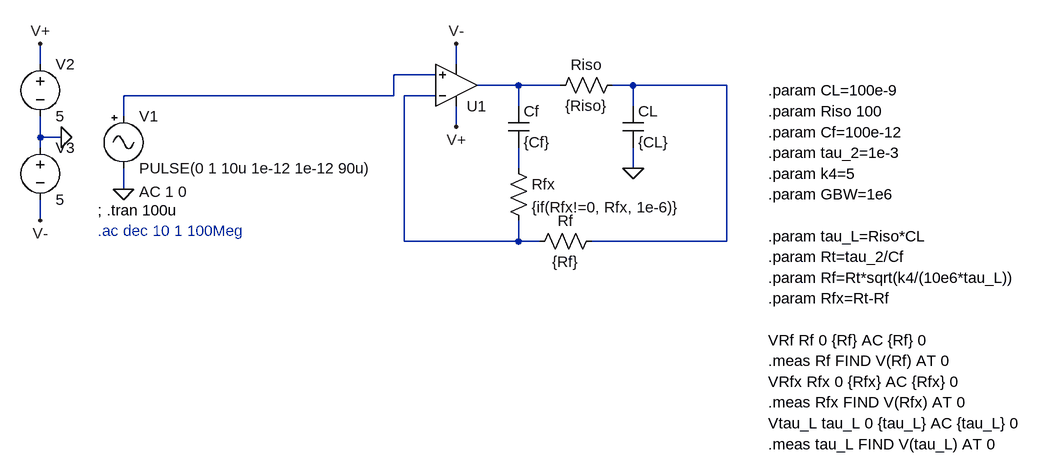
[diagram p0: schematic op-amp-capacitor-compensated.asc]
op-amp-capacitor-compensated.asc, the LTspice schematic file:
Version 4
SHEET 1 2176 680
WIRE -16 32 -16 0
WIRE 624 32 624 0
WIRE 592 48 528 48
WIRE 720 64 656 64
WIRE 784 64 720 64
WIRE 896 64 864 64
WIRE 1040 64 896 64
WIRE 528 80 528 48
WIRE 528 80 112 80
WIRE 592 80 544 80
WIRE 720 96 720 64
WIRE 896 96 896 64
WIRE 112 112 112 80
WIRE 624 128 624 96
WIRE -16 144 -16 112
WIRE 16 144 -16 144
WIRE -16 160 -16 144
WIRE 720 192 720 160
WIRE 896 192 896 160
WIRE 112 224 112 192
WIRE -16 272 -16 240
WIRE 544 304 544 80
WIRE 720 304 720 272
WIRE 720 304 544 304
WIRE 752 304 720 304
WIRE 1040 304 1040 64
WIRE 1040 304 832 304
FLAG 112 224 0
FLAG 624 0 V-
FLAG 624 128 V+
FLAG 16 144 0
FLAG -16 0 V+
FLAG -16 272 V-
FLAG 896 192 0
SYMBOL Misc\\signal 112 96 R0
WINDOW 123 24 132 Left 2
WINDOW 39 0 0 Left 0
SYMATTR Value2 AC 1 0
SYMATTR InstName V1
SYMATTR Value PULSE(0 1 10u 1e-12 1e-12 90u)
SYMBOL OpAmps\\UniversalOpAmp 624 64 M180
SYMATTR InstName U1
SYMATTR Value2 Avol=1e12 GBW=1e12 Vos=0
SYMATTR SpiceLine En=0 Enk=0 In=0 Ink=0 Rin=1e12
SYMBOL voltage -16 16 R0
WINDOW 123 0 0 Left 0
WINDOW 39 0 0 Left 0
SYMATTR InstName V2
SYMATTR Value 5
SYMBOL voltage -16 144 R0
WINDOW 123 0 0 Left 0
WINDOW 39 0 0 Left 0
SYMATTR InstName V3
SYMATTR Value 5
SYMBOL res 880 48 R90
WINDOW 0 0 56 VBottom 2
WINDOW 3 32 56 VTop 2
SYMATTR InstName Riso
SYMATTR Value {Riso}
SYMBOL cap 880 96 R0
SYMATTR InstName CL
SYMATTR Value {CL}
SYMBOL cap 704 96 R0
SYMATTR InstName Cf
SYMATTR Value {Cf}
SYMBOL res 704 176 R0
SYMATTR InstName Rfx
SYMATTR Value {if(Rfx!=0, Rfx, 1e-6)}
SYMBOL res 848 288 R90
WINDOW 0 0 56 VBottom 2
WINDOW 3 32 56 VTop 2
SYMATTR InstName Rf
SYMATTR Value {Rf}
TEXT 72 256 Left 2 !; .tran 100u
TEXT 1104 72 Left 2 !.param CL=100e-9
TEXT 1104 104 Left 2 !.param Riso 100
TEXT 1104 136 Left 2 !.param Cf=100e-12
TEXT 1104 296 Left 2 !.param tau_L=Riso*CL
TEXT 1104 456 Left 2 !VRf Rf 0 {Rf} AC {Rf} 0
TEXT 1104 488 Left 2 !.meas Rf FIND V(Rf) AT 0
TEXT 72 288 Left 2 ;.ac dec 10 1 100Meg
TEXT 1104 168 Left 2 !.param tau_2=1e-3
TEXT 1104 328 Left 2 !.param Rt=tau_2/Cf
TEXT 1104 360 Left 2 !.param Rf=Rt*sqrt(k4/(10e6*tau_L))
TEXT 1104 392 Left 2 !.param Rfx=Rt-Rf
TEXT 1104 200 Left 2 !.param k4=5
TEXT 1104 232 Left 2 !.param GBW=1e6
TEXT 1104 520 Left 2 !VRfx Rfx 0 {Rfx} AC {Rfx} 0
TEXT 1104 552 Left 2 !.meas Rfx FIND V(Rfx) AT 0
TEXT 1104 584 Left 2 !Vtau_L tau_L 0 {tau_L} AC {tau_L} 0
TEXT 1104 616 Left 2 !.meas tau_L FIND V(tau_L) AT 0

The netlist it stands for:
* op-amp-capacitor-compensated.asc
V1 N001 0 PULSE(0 1 10u 1e-12 1e-12 90u) AC 1 0
XU1 N001 N004 V+ V- N002 level1 Avol=1e12 GBW=1e12 Vos=0 En=0 Enk=0 In=0 Ink=0 Rin=1e12  ; pins In+ In- V+ V- OUT
V2 V+ 0 5
V3 0 V- 5
Riso N003 N002 {Riso}
CL N003 0 {CL}
Cf N002 N005 {Cf}
Rfx N005 N004 {if(Rfx!=0, Rfx, 1e-6)}
Rf N003 N004 {Rf}
; .tran 100u
.param CL=100e-9
.param Riso 100
.param Cf=100e-12
.param tau_L=Riso*CL
VRf Rf 0 {Rf} AC {Rf} 0
.meas Rf FIND V(Rf) AT 0
* .ac dec 10 1 100Meg
.param tau_2=1e-3
.param Rt=tau_2/Cf
.param Rf=Rt*sqrt(k4/(10e6*tau_L))
.param Rfx=Rt-Rf
.param k4=5
.param GBW=1e6
VRfx Rfx 0 {Rfx} AC {Rfx} 0
.meas Rfx FIND V(Rfx) AT 0
Vtau_L tau_L 0 {tau_L} AC {tau_L} 0
.meas tau_L FIND V(tau_L) AT 0
.lib UniversalOpAmp1.lib
.backanno
.end